# Altium schematic sheet Power.SchDoc: Power
size A4; Date: 21.09.2023; ApprovedBy: Prof. Dr. Jens Anders; CheckedBy: M.Sc. Tobias Wirth; Author: M.Sc. Tobias Wirth; CompanyName: IIS; DrawnBy: M.Sc. Tobias Wirth; Engineer: M.Sc. Tobias Wirth; Organization: University of Stuttgart; Address1: Pfaffenwaldring 47; Address2: 70569 Stuttgart; Revision: V0.1; SheetNumber: 2; SheetTotal: 2; ProjectNameAlt: AUS - NMR System; Time: 15:03; ImagePath: N/A; Application_BuildNumber: N/A
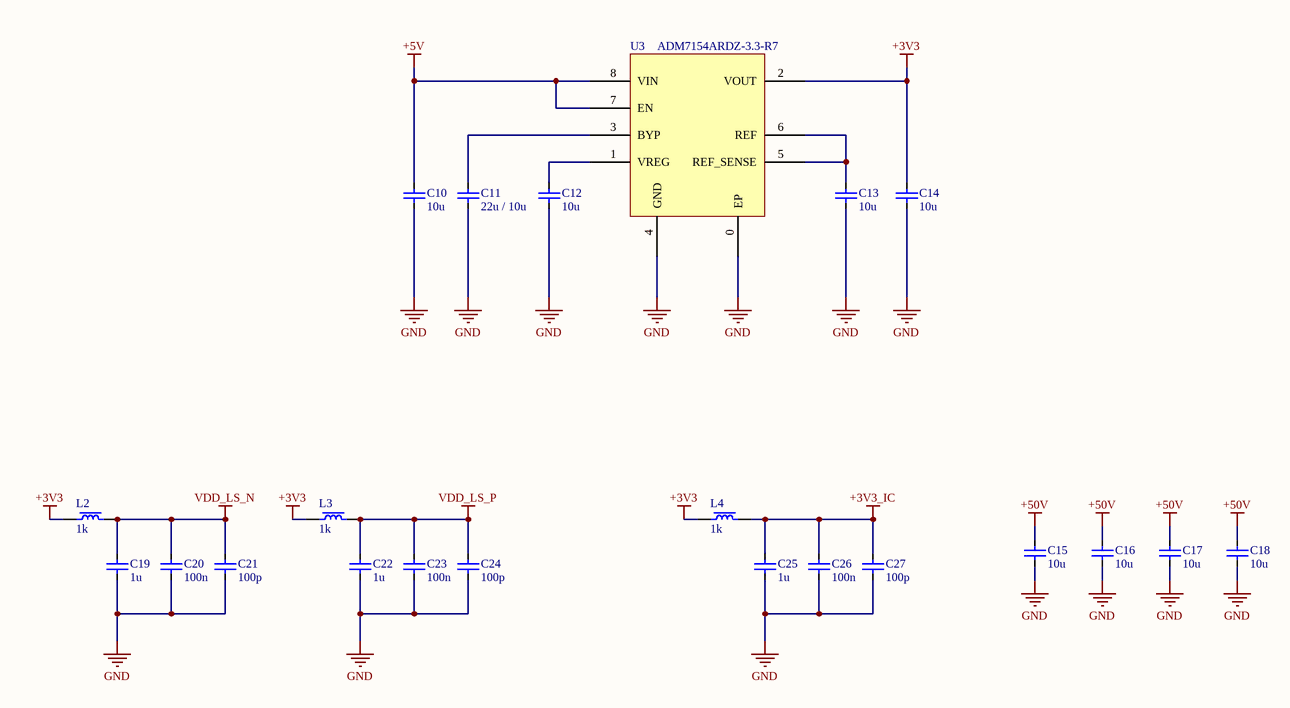
[diagram p0: Power.SchDoc]

## Parts
C10  10u  [CAP_0603]
C11  22u / 10u  [CAP_0603]
C12  10u  [CAP_0603]
C13  10u  [CAP_0603]
C14  10u  [CAP_0603]
C15  10u  [CAP_0805]
C16  10u  [CAP_0805]
C17  10u  [CAP_0805]
C18  10u  [CAP_0805]
C19  1u  [CAP_0603]
C20  100n  [CAP_0603]
C21  100p  [CAP_0603]
C22  1u  [CAP_0603]
C23  100n  [CAP_0603]
C24  100p  [CAP_0603]
C25  1u  [CAP_0603]
C26  100n  [CAP_0603]
C27  100p  [CAP_0603]
L2  1k  [CAP_0603]
L3  1k  [CAP_0603]
L4  1k  [CAP_0603]
U3  ADM7154ARDZ-3.3-R7  [SOIC-8_TP]

## Nets
+3V3: C14.1 L2.1 L3.1 L4.1 U3.2(VOUT)
+3V3_IC: C25.1 C26.1 C27.1 L4.2
+5V: C10.1 U3.7(EN) U3.8(VIN)
+50V: C15.1 C16.1 C17.1 C18.1
GND: C10.2 C11.2 C12.2 C13.2 C14.2 C15.2 C16.2 C17.2 C18.2 C19.2 C20.2 C21.2 C22.2 C23.2 C24.2 C25.2 C26.2 C27.2 U3.0(EP) U3.4(GND)
VDD_LS_N: C19.1 C20.1 C21.1 L2.2
VDD_LS_P: C22.1 C23.1 C24.1 L3.2
NetC11_1: C11.1 U3.3(BYP)
NetC12_1: C12.1 U3.1(VREG)
NetC13_1: C13.1 U3.5(REF_SENSE) U3.6(REF)

## Notes on the sheet
- Title
- Size
- Date:
- Sheet
- A4
- of
- Project
- Drawn By:
- Revision:

## Library data of the parts
C10-C27 = Cap: Supplier: *; Part Number: *
  C10 C12-C18: Value: 10u
  C11: Value: 22u / 10u
  C19 C22 C25: Value: 1u
  C20 C23 C26: Value: 100n
  C21 C24 C27: Value: 100p
L2-L4 = FerriteBead: Part Number: *; Supplier: *; Value: 1k
U3 = ADM715X